# Altium schematic sheet 01 Touch Sensing Keys.SchDoc
size A3; CheckedBy: TBD; Engineer: Lukas Henkel; Revision: 0.2; SheetNumber: 2; SheetTotal: 3
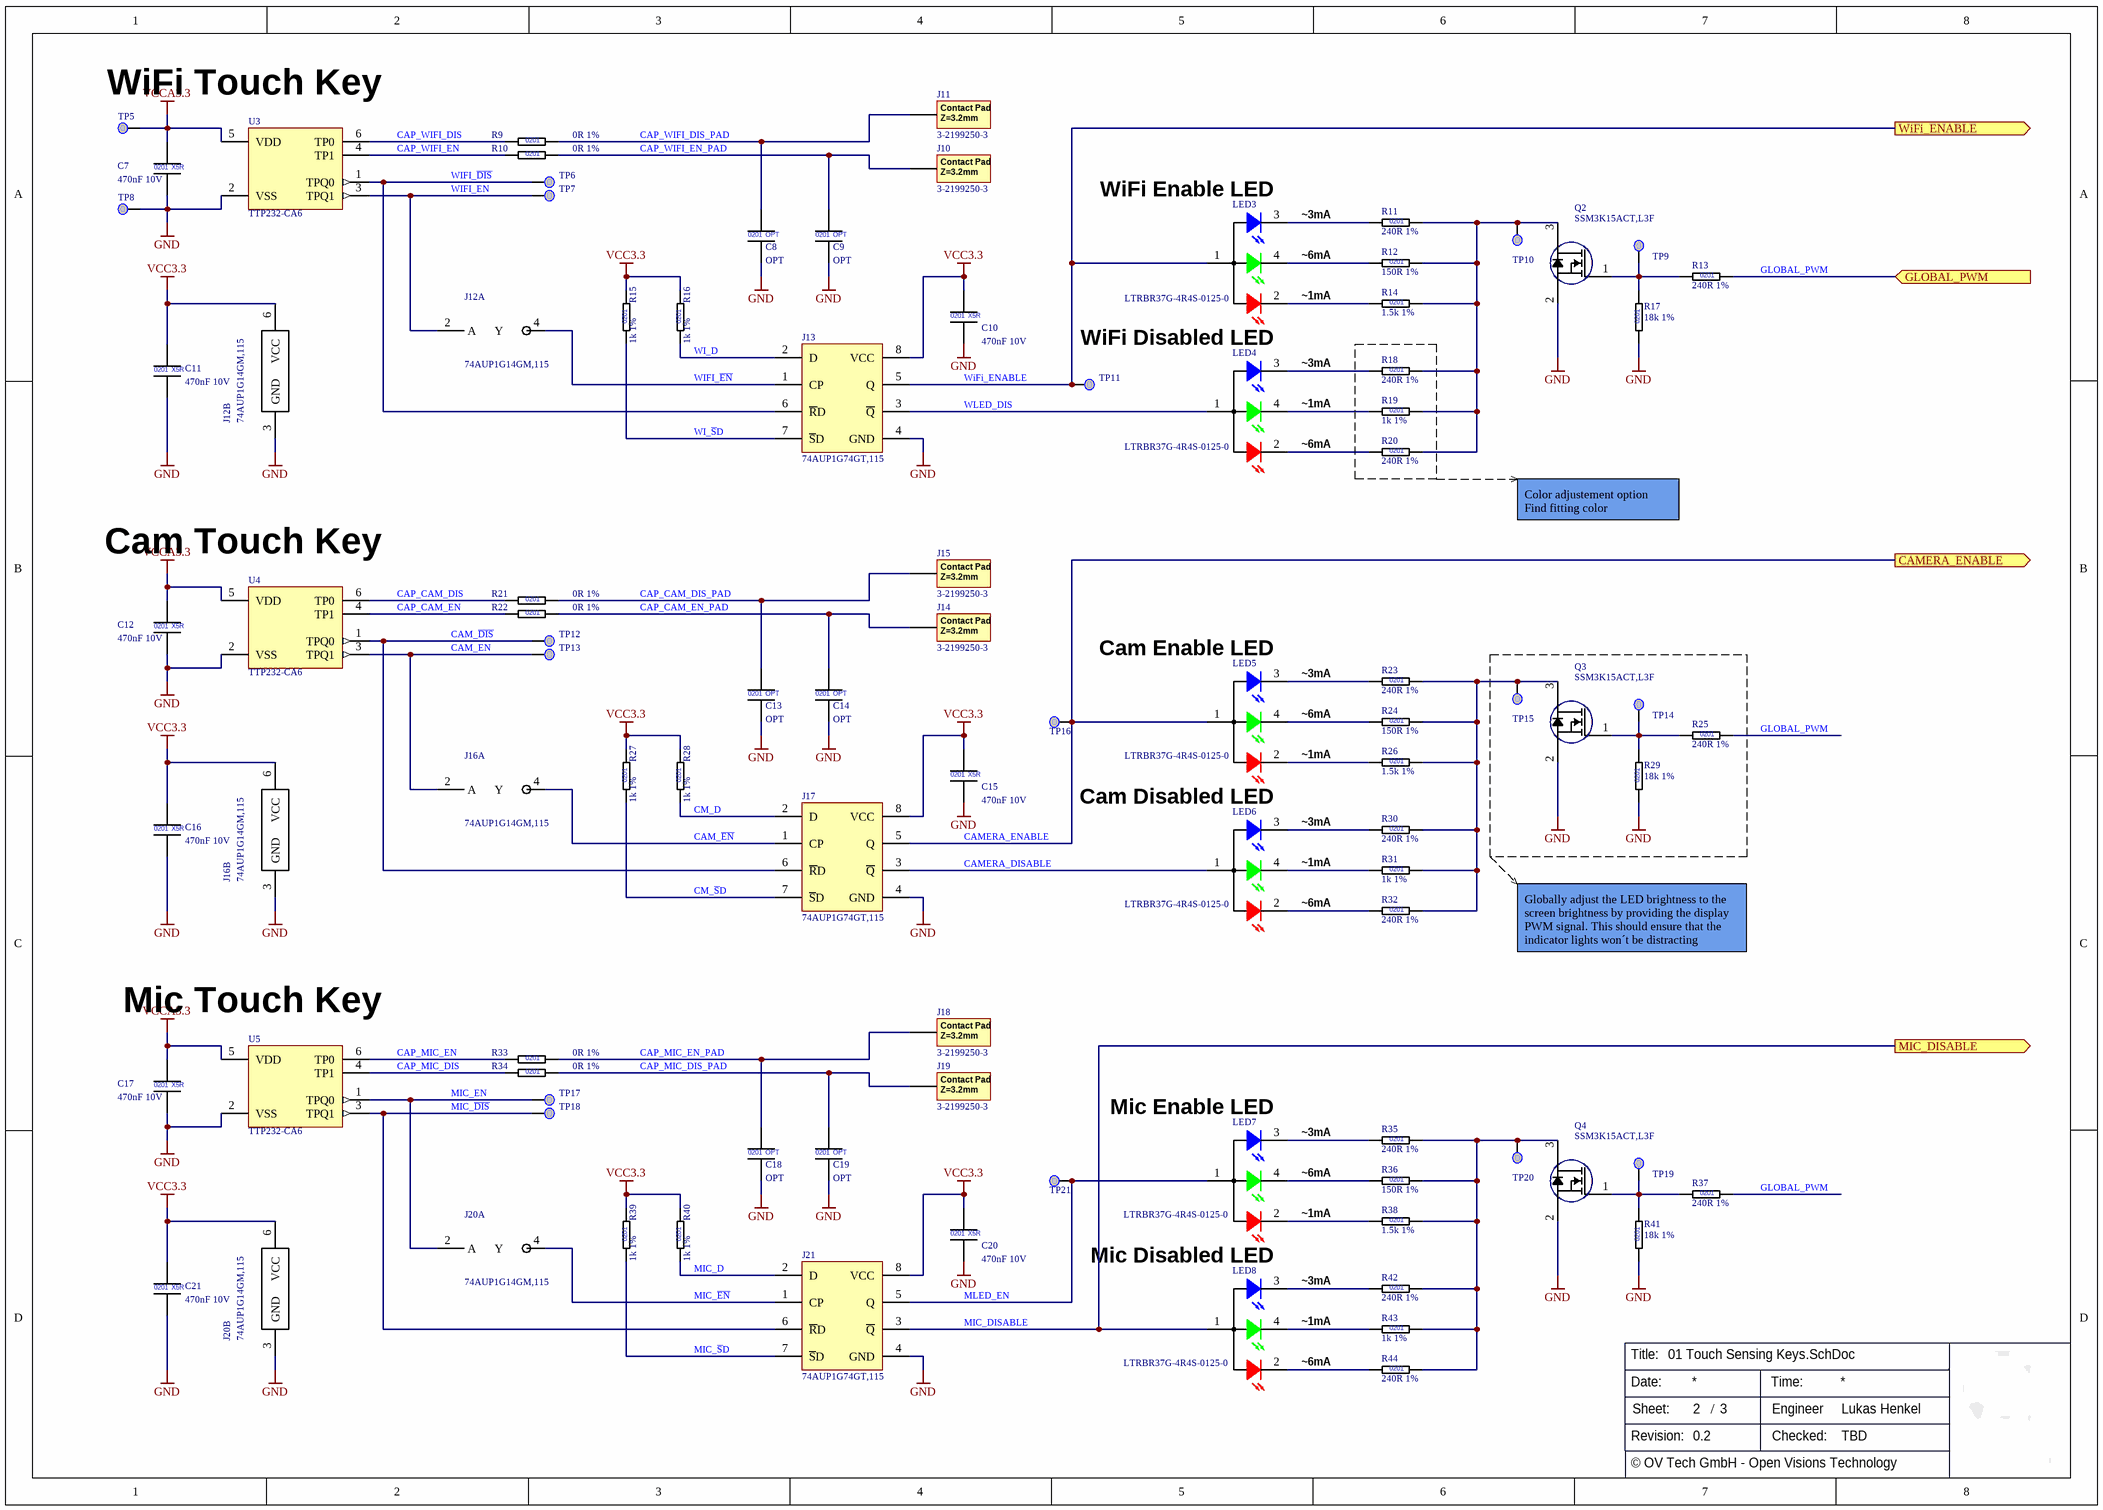
[diagram p0: 01 Touch Sensing Keys.SchDoc]

## Parts
C7  470nF 10V  [CAPC0603X03L]
C8  OPT  [CAPC0603X03L]  (no BOM)
C9  OPT  [CAPC0603X03L]  (no BOM)
C10  470nF 10V  [CAPC0603X03L]
C11  470nF 10V  [CAPC0603X03L]
C12  470nF 10V  [CAPC0603X03L]
C13  OPT  [CAPC0603X03L]  (no BOM)
C14  OPT  [CAPC0603X03L]  (no BOM)
C15  470nF 10V  [CAPC0603X03L]
C16  470nF 10V  [CAPC0603X03L]
C17  470nF 10V  [CAPC0603X03L]
C18  OPT  [CAPC0603X03L]  (no BOM)
C19  OPT  [CAPC0603X03L]  (no BOM)
C20  470nF 10V  [CAPC0603X03L]
C21  470nF 10V  [CAPC0603X03L]
J10  3-2199250-3  [Contact Pad_3.2mm_3-2199250-3]
J11  3-2199250-3  [Contact Pad_3.2mm_3-2199250-3]
J12  74AUP1G14GM,115  [PSON50P140X100X50-6L]  (parts A,B of 2)
J13  74AUP1G74GT,115  [PSON50P100X50-8L]
J14  3-2199250-3  [Contact Pad_3.2mm_3-2199250-3]
J15  3-2199250-3  [Contact Pad_3.2mm_3-2199250-3]
J16  74AUP1G14GM,115  [PSON50P140X100X50-6L]  (parts A,B of 2)
J17  74AUP1G74GT,115  [PSON50P100X50-8L]
J18  3-2199250-3  [Contact Pad_3.2mm_3-2199250-3]
J19  3-2199250-3  [Contact Pad_3.2mm_3-2199250-3]
J20  74AUP1G14GM,115  [PSON50P140X100X50-6L]  (parts A,B of 2)
J21  74AUP1G74GT,115  [PSON50P100X50-8L]
LED3  LTRBR37G-4R4S-0125-0  [LED 120X120 LTRB R37G RGB]
LED4  LTRBR37G-4R4S-0125-0  [LED 120X120 LTRB R37G RGB]
LED5  LTRBR37G-4R4S-0125-0  [LED 120X120 LTRB R37G RGB]
LED6  LTRBR37G-4R4S-0125-0  [LED 120X120 LTRB R37G RGB]
LED7  LTRBR37G-4R4S-0125-0  [LED 120X120 LTRB R37G RGB]
LED8  LTRBR37G-4R4S-0125-0  [LED 120X120 LTRB R37G RGB]
Q2  SSM3K15ACT,L3F  [DFN65P100X50-3L]
Q3  SSM3K15ACT,L3F  [DFN65P100X50-3L]
Q4  SSM3K15ACT,L3F  [DFN65P100X50-3L]
R9  0R 1%  [RESC0603X03L]
R10  0R 1%  [RESC0603X03L]
R11  240R 1%  [RESC0603X03L]
R12  150R 1%  [RESC0603X03L]
R13  240R 1%  [RESC0603X03L]
R14  1.5k 1%  [RESC0603X03L]
R15  1k 1%  [RESC0603X03L]
R16  1k 1%  [RESC0603X03L]
R17  18k 1%  [RESC0603X03L]
R18  240R 1%  [RESC0603X03L]
R19  1k 1%  [RESC0603X03L]
R20  240R 1%  [RESC0603X03L]
R21  0R 1%  [RESC0603X03L]
R22  0R 1%  [RESC0603X03L]
R23  240R 1%  [RESC0603X03L]
R24  150R 1%  [RESC0603X03L]
R25  240R 1%  [RESC0603X03L]
R26  1.5k 1%  [RESC0603X03L]
R27  1k 1%  [RESC0603X03L]
R28  1k 1%  [RESC0603X03L]
R29  18k 1%  [RESC0603X03L]
R30  240R 1%  [RESC0603X03L]
R31  1k 1%  [RESC0603X03L]
R32  240R 1%  [RESC0603X03L]
R33  0R 1%  [RESC0603X03L]
R34  0R 1%  [RESC0603X03L]
R35  240R 1%  [RESC0603X03L]
R36  150R 1%  [RESC0603X03L]
R37  240R 1%  [RESC0603X03L]
R38  1.5k 1%  [RESC0603X03L]
R39  1k 1%  [RESC0603X03L]
R40  1k 1%  [RESC0603X03L]
R41  18k 1%  [RESC0603X03L]
R42  240R 1%  [RESC0603X03L]
R43  1k 1%  [RESC0603X03L]
R44  240R 1%  [RESC0603X03L]
TP5  Testpoint 0.5mm  [TP_0.50mm]  (value not drawn)  (no BOM)
TP6  Testpoint 0.5mm  [TP_0.50mm]  (value not drawn)  (no BOM)
TP7  Testpoint 0.5mm  [TP_0.50mm]  (value not drawn)  (no BOM)
TP8  Testpoint 0.5mm  [TP_0.50mm]  (value not drawn)  (no BOM)
TP9  Testpoint 0.5mm  [TP_0.50mm]  (value not drawn)  (no BOM)
TP10  Testpoint 0.5mm  [TP_0.50mm]  (value not drawn)  (no BOM)
TP11  Testpoint 0.5mm  [TP_0.50mm]  (value not drawn)  (no BOM)
TP12  Testpoint 0.5mm  [TP_0.50mm]  (value not drawn)  (no BOM)
TP13  Testpoint 0.5mm  [TP_0.50mm]  (value not drawn)  (no BOM)
TP14  Testpoint 0.5mm  [TP_0.50mm]  (value not drawn)  (no BOM)
TP15  Testpoint 0.5mm  [TP_0.50mm]  (value not drawn)  (no BOM)
TP16  Testpoint 0.5mm  [TP_0.50mm]  (value not drawn)  (no BOM)
TP17  Testpoint 0.5mm  [TP_0.50mm]  (value not drawn)  (no BOM)
TP18  Testpoint 0.5mm  [TP_0.50mm]  (value not drawn)  (no BOM)
TP19  Testpoint 0.5mm  [TP_0.50mm]  (value not drawn)  (no BOM)
TP20  Testpoint 0.5mm  [TP_0.50mm]  (value not drawn)  (no BOM)
TP21  Testpoint 0.5mm  [TP_0.50mm]  (value not drawn)  (no BOM)
U3  TTP232-CA6  [SOT95P285X126-6L]
U4  TTP232-CA6  [SOT95P285X126-6L]
U5  TTP232-CA6  [SOT95P285X126-6L]

## Ports
CAMERA_ENABLE (out), GLOBAL_PWM (in), MIC_DISABLE (out), WiFi_ENABLE (out)

## Nets
GND: C7.2 C8.2 C9.2 C10.2 C11.2 C12.2 C13.2 C14.2 C15.2 C16.2 C17.2 C18.2 C19.2 C20.2 C21.2 J12.3(GND) J13.4(GND) J16.3(GND) J17.4(GND) J20.3(GND) J21.4(GND) Q2.2(S) Q3.2(S) Q4.2(S) R17.1 R29.1 R41.1 TP8.TP U3.2(VSS) U4.2(VSS) U5.2(VSS)
VCC3.3: C10.1 C11.1 C15.1 C16.1 C20.1 C21.1 J12.6(VCC) J13.8(VCC) J16.6(VCC) J17.8(VCC) J20.6(VCC) J21.8(VCC) R15.2 R16.2 R27.2 R28.2 R39.2 R40.2
VCCA3.3: C7.1 C12.1 C17.1 TP5.TP U3.5(VDD) U4.5(VDD) U5.5(VDD)
CAM_~{DIS}: J17.6(~{R}D) TP12.TP U4.1(TPQ0)
CAM_~{EN}: J16.4(Y) J17.1(CP)
CAM_EN: J16.2(A) TP13.TP U4.3(TPQ1)
CAMERA_DISABLE: J17.3(~{Q}) LED6.1
CAMERA_ENABLE: J17.5(Q) LED5.1 TP16.TP ; port CAMERA_ENABLE
CAP_CAM_DIS: R21.1 U4.6(TP0)
CAP_CAM_DIS_PAD: C13.1 J15.1 R21.2
CAP_CAM_EN: R22.1 U4.4(TP1)
CAP_CAM_EN_PAD: C14.1 J14.1 R22.2
CAP_MIC_DIS: R34.1 U5.4(TP1)
CAP_MIC_DIS_PAD: C19.1 J19.1 R34.2
CAP_MIC_EN: R33.1 U5.6(TP0)
CAP_MIC_EN_PAD: C18.1 J18.1 R33.2
CAP_WIFI_DIS: R9.1 U3.6(TP0)
CAP_WIFI_DIS_PAD: C8.1 J11.1 R9.2
CAP_WIFI_EN: R10.1 U3.4(TP1)
CAP_WIFI_EN_PAD: C9.1 J10.1 R10.2
CM_D: J17.2(D) R28.1
CM_~{S}D: J17.7(~{S}D) R27.1
GLOBAL_PWM: R13.2 R25.2 R37.2 ; port GLOBAL_PWM
MIC_D: J21.2(D) R40.1
MIC_~{DIS}: J21.6(~{R}D) TP18.TP U5.3(TPQ1)
MIC_DISABLE: J21.3(~{Q}) LED8.1 ; port MIC_DISABLE
MIC_~{EN}: J20.4(Y) J21.1(CP)
MIC_EN: J20.2(A) TP17.TP U5.1(TPQ0)
MIC_~{S}D: J21.7(~{S}D) R39.1
MLED_EN: J21.5(Q) LED7.1 TP21.TP
WI_D: J13.2(D) R16.1
WI_~{S}D: J13.7(~{S}D) R15.1
WIFI_~{DIS}: J13.6(~{R}D) TP6.TP U3.1(TPQ0)
WIFI_~{EN}: J12.4(Y) J13.1(CP)
WIFI_EN: J12.2(A) TP7.TP U3.3(TPQ1)
WiFi_ENABLE: J13.5(Q) LED3.1 TP11.TP ; port WiFi_ENABLE
WLED_DIS: J13.3(~{Q}) LED4.1
NetLED3_2: LED3.2 R14.1
NetLED3_3: LED3.3 R11.1
NetLED3_4: LED3.4 R12.1
NetLED4_2: LED4.2 R20.1
NetLED4_3: LED4.3 R18.1
NetLED4_4: LED4.4 R19.1
NetLED5_2: LED5.2 R26.1
NetLED5_3: LED5.3 R23.1
NetLED5_4: LED5.4 R24.1
NetLED6_2: LED6.2 R32.1
NetLED6_3: LED6.3 R30.1
NetLED6_4: LED6.4 R31.1
NetLED7_2: LED7.2 R38.1
NetLED7_3: LED7.3 R35.1
NetLED7_4: LED7.4 R36.1
NetLED8_2: LED8.2 R44.1
NetLED8_3: LED8.3 R42.1
NetLED8_4: LED8.4 R43.1
NetQ2_1: Q2.1(G) R13.1 R17.2 TP9.TP
NetQ2_3: Q2.3(D) R11.2 R12.2 R14.2 R18.2 R19.2 R20.2 TP10.TP
NetQ3_1: Q3.1(G) R25.1 R29.2 TP14.TP
NetQ3_3: Q3.3(D) R23.2 R24.2 R26.2 R30.2 R31.2 R32.2 TP15.TP
NetQ4_1: Q4.1(G) R37.1 R41.2 TP19.TP
NetQ4_3: Q4.3(D) R35.2 R36.2 R38.2 R42.2 R43.2 R44.2 TP20.TP

## Notes on the sheet
- WiFi Touch Key
- WiFi Enable LED
- ~3mA
- WiFi Disabled LED
- ~6mA
- ~1mA
- Cam Touch Key
- Color adjustement option
  Find fitting color experimentally
- Cam Enable LED
- Cam Disabled LED
- Mic Touch Key
- Globally adjust the LED brightness to the screen brightness by providing the display PWM signal. This should ensure that the indicator lights won´t be distracting
- Mic Enable LED
- Mic Disabled LED
- Title:
- Date:
- Time:
- Revision:
- Sheet:
- /
- Engineer
- Checked:
- © OV Tech GmbH - Open Visions Technology
- (in symbol CAP_0201_470nF_10V) 0201; X5R
- (in symbol CAP_0201_OPT) 0201
- (in symbol PAD_3-2199250-3) Contact Pad; Z=3.2mm
- (in symbol RES_0201_0R_1%) 0201
- (in symbol RES_0201_1.5k_1%) 0201
- (in symbol RES_0201_1k_1%) 0201
- (in symbol RES_0201_18k_1%) 0201
- (in symbol RES_0201_150R_1%) 0201
- (in symbol RES_0201_240R_1%) 0201

## Library data of the parts
C7 C10-C12 C15-C17 C20 C21 = CAP_0201_470nF_10V: Multilayer Ceramic Capacitors MLCC - SMD/SMT 0201 10VDC; Manufacturer 1: Taiyo Yuden; Manufacturer 1 Prt. Nr.: LMK063BBJ474KPLF; Manufacturer 2 Prt. Nr.: C0603X5R1A474M030BC; Manufacturer 2: TDK
C8 C9 C13 C14 C18 C19 = CAP_0201_OPT: Optional Capacitor 0201
J10 J11 J14 J15 J18 J19 = PAD_3-2199250-3: SMD Contact pad spring loaded 3.2mm; Manufacturer 1: TE Connectivity; Manufacturer 1 Prt. Nr.: 3-2199250-3
J12 J16 J20 = Inverter_74AUP1G14GM,115: Single Unbuffered Inverter 74AUP1G14GM,115; Manufacturer 1: Nexperia; Manufacturer 1 Prt. Nr.: 74AUP1G14GM,115
J13 J17 J21 = D-FLOP_SMG-W-2,0x1,2x1,25-AU: D-type flip-flop with differential output and async set- and reset input; Manufacturer 1: Nexperia; Manufacturer 1 Prt. Nr.: 74AUP1G74GT,115
LED3-LED8 = LED RGB Low Profile_LTRBR37G-4R4S-0125-0: Micro LED Ultra Low Profile 1.2mm X 1.2mm X 0.25mm LTRBR37G; Manufacturer 1: ams OSRAM; Manufacturer 1 Prt. Nr.: LTRBR37G-4R4S-0125-0
Q2-Q4 = N-Channel MOSFET_SSM3K15ACT,L3F: MOSFET 30V SGL N-CH TRENCHMOS Logic Level; Manufacturer 1: Toshiba; Manufacturer 1 Prt. Nr.: SSM3K15ACT,L3F
R9 R10 R21 R22 R33 R34 = RES_0201_0R_1%: Thick Film Resistors - SMD 0R OHM 1%; Manufacturer 1: Yageo; Manufacturer 1 Prt. Nr.: RC0201FR-070RL; Manufacturer 2 Prt. Nr.: CRCW02010000Z0ED; Manufacturer 2: Vishay / Dale
R11 R13 R18 R20 R23 R25 R30 R32 R35 R37 R42 R44 = RES_0201_240R_1%: Thick Film Resistors - SMD 240 OHM 1%; Manufacturer 1: Yageo; Manufacturer 1 Prt. Nr.: RC0201FR-07240RL; Manufacturer 2 Prt. Nr.: CRCW0201240RFNED; Manufacturer 2: Vishay / Dale
R12 R24 R36 = RES_0201_150R_1%: Thick Film Resistors - SMD 150 OHM 1%; Manufacturer 1: Yageo; Manufacturer 1 Prt. Nr.: RC0201FR-07150RL; Manufacturer 2 Prt. Nr.: CRCW0201150RFNED; Manufacturer 2: Vishay / Dale
R14 R26 R38 = RES_0201_1.5k_1%: Thick Film Resistors - SMD 1.5K OHM 1%; Manufacturer 1: Yageo; Manufacturer 1 Prt. Nr.: RC0201FR-071K5L; Manufacturer 2 Prt. Nr.: CRCW02011K50FNED; Manufacturer 2: Vishay / Dale
R15 R16 R19 R27 R28 R31 R39 R40 R43 = RES_0201_1k_1%: Thick Film Resistors - SMD 1K OHM 1%; Manufacturer 1: Yageo; Manufacturer 1 Prt. Nr.: RC0201FR-071KL; Manufacturer 2 Prt. Nr.: CRCW02011K00FNED; Manufacturer 2: Vishay / Dale
R17 R29 R41 = RES_0201_18k_1%: Thick Film Resistors - SMD 18K OHM 1%; Manufacturer 1: Panasonic; Manufacturer 1 Prt. Nr.: ERJ-1GNF1802C; Manufacturer 2 Prt. Nr.: RK73H1HTTC1802F; Manufacturer 2: KOA Speer
U3-U5 = Dual key capacitive touch sensing_TTP232-CA6: Two key touch pad detector IC TTP232-CA6; Manufacturer 1: Tontek Design Tech; Manufacturer 1 Prt. Nr.: TTP232-CA6